# Altium schematic sheet 系统方案2.SchDoc
size A4; SheetNumber: 1; SheetTotal: 2
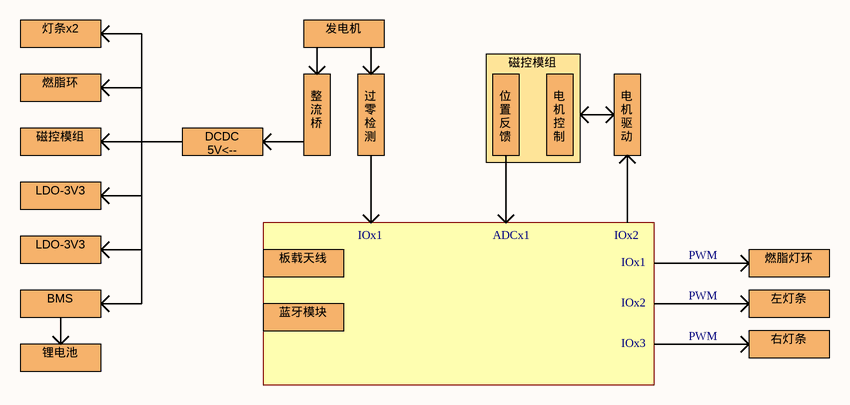
[diagram p0: 系统方案2.SchDoc]

## Notes on the sheet
- 灯条x2
- 发电机
- 磁控模组
- 燃脂环
- DCDC
  5V<--
- 整
  流
  桥
- 过
  零
  检
  测
- 位
  置
  反
  馈
- 电
  机
  控
  制
- 电
  机
  驱
  动
- LDO-3V3
- 板载天线
- IOx1
- ADCx1
- IOx2
- PWM
- 燃脂灯环
- BMS
- 蓝牙模块
- IOx3
- 左灯条
- 右灯条
- 锂电池